# Altium schematic sheet S7CAS-PLEIADES-CARTE-MERE_P01_CNA.SchDoc
size Tabloid; DocumentNumber: 6; SheetNumber: 6; SheetTotal: 17; Sheet_Name: CNA; Size: 11x17
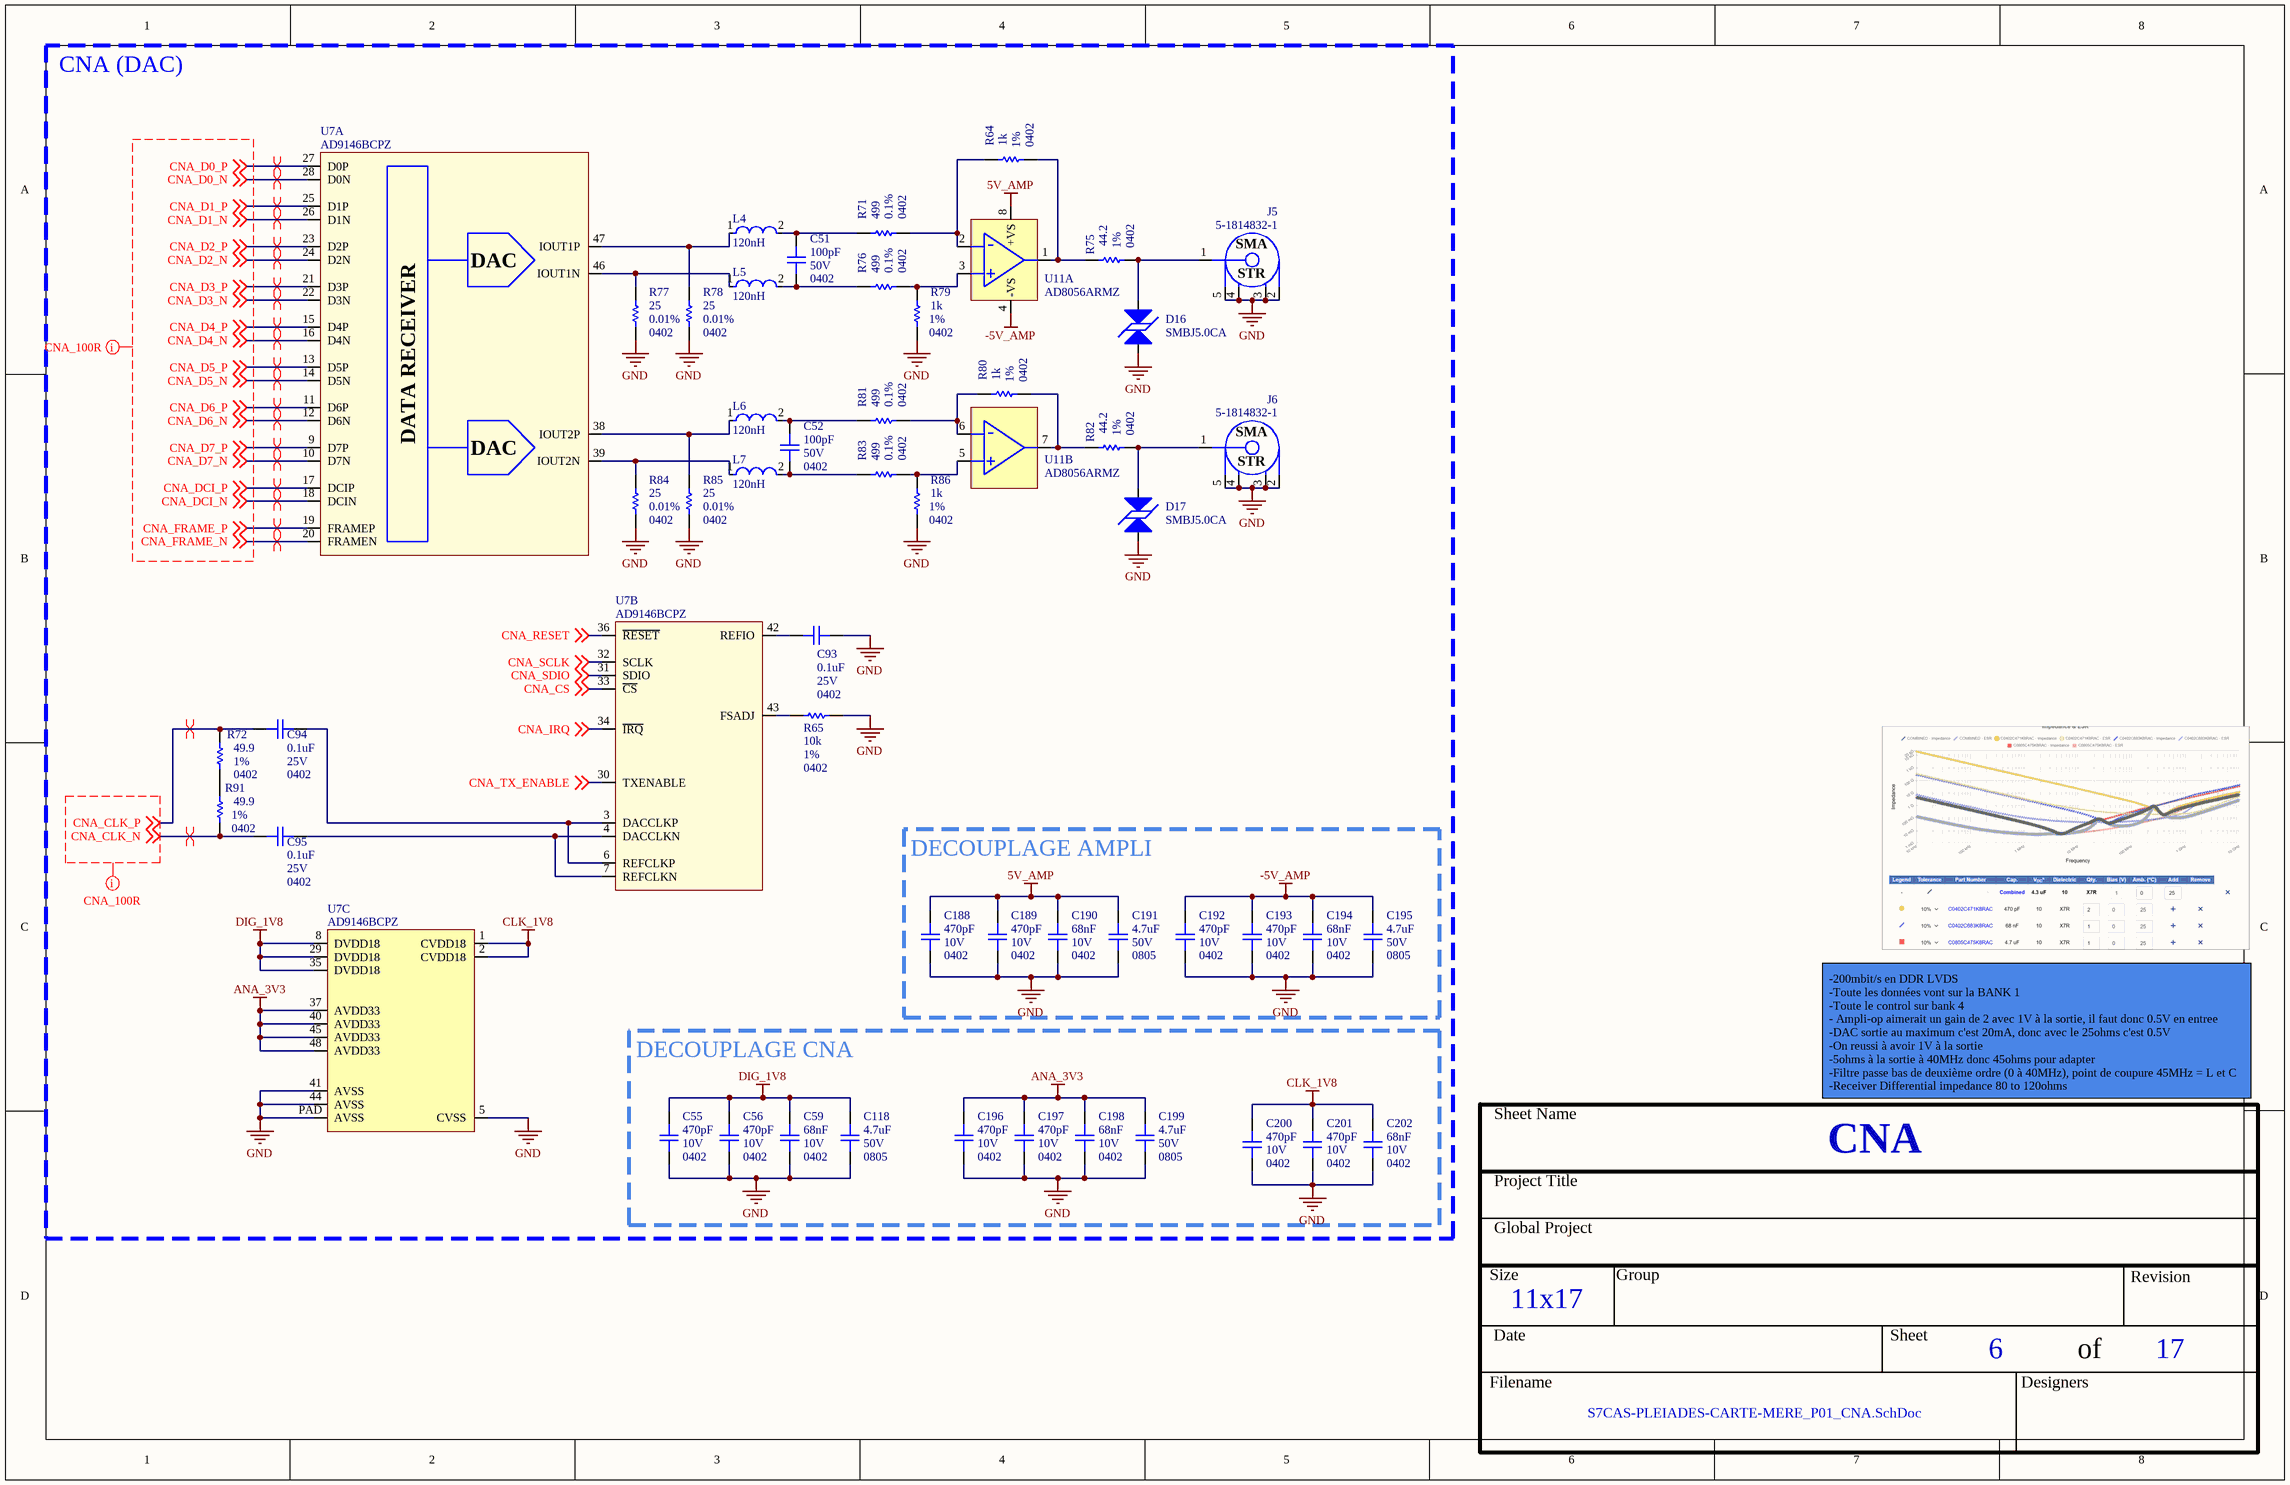
[diagram p0: S7CAS-PLEIADES-CARTE-MERE_P01_CNA.SchDoc]

## Parts
C51  value 100pF  Voltage: 50V  Package: 0402  [CAP_0402]  (hidden comment: CAP - 0402)
C52  value 100pF  Voltage: 50V  Package: 0402  [CAP_0402]  (hidden comment: CAP - 0402)
C55  value 470pF  Voltage: 10V  Package: 0402  [CAP_0402]  (hidden comment: CAP - 0402)
C56  value 470pF  Voltage: 10V  Package: 0402  [CAP_0402]  (hidden comment: CAP - 0402)
C59  value 68nF  Voltage: 10V  Package: 0402  [CAP_0402]  (hidden comment: CAP - 0402)
C93  value 0.1uF  Voltage: 25V  Package: 0402  [CAP_0402]  (hidden comment: CAP - 0402)
C94  value 0.1uF  Voltage: 25V  Package: 0402  [CAP_0402]  (hidden comment: CAP - 0402)
C95  value 0.1uF  Voltage: 25V  Package: 0402  [CAP_0402]  (hidden comment: CAP - 0402)
C118  value 4.7uF  Voltage: 50V  Package: 0805  [CAP_0805]  (hidden comment: CAP - 0805)
C188  value 470pF  Voltage: 10V  Package: 0402  [CAP_0402]  (hidden comment: CAP - 0402)
C189  value 470pF  Voltage: 10V  Package: 0402  [CAP_0402]  (hidden comment: CAP - 0402)
C190  value 68nF  Voltage: 10V  Package: 0402  [CAP_0402]  (hidden comment: CAP - 0402)
C191  value 4.7uF  Voltage: 50V  Package: 0805  [CAP_0805]  (hidden comment: CAP - 0805)
C192  value 470pF  Voltage: 10V  Package: 0402  [CAP_0402]  (hidden comment: CAP - 0402)
C193  value 470pF  Voltage: 10V  Package: 0402  [CAP_0402]  (hidden comment: CAP - 0402)
C194  value 68nF  Voltage: 10V  Package: 0402  [CAP_0402]  (hidden comment: CAP - 0402)
C195  value 4.7uF  Voltage: 50V  Package: 0805  [CAP_0805]  (hidden comment: CAP - 0805)
C196  value 470pF  Voltage: 10V  Package: 0402  [CAP_0402]  (hidden comment: CAP - 0402)
C197  value 470pF  Voltage: 10V  Package: 0402  [CAP_0402]  (hidden comment: CAP - 0402)
C198  value 68nF  Voltage: 10V  Package: 0402  [CAP_0402]  (hidden comment: CAP - 0402)
C199  value 4.7uF  Voltage: 50V  Package: 0805  [CAP_0805]  (hidden comment: CAP - 0805)
C200  value 470pF  Voltage: 10V  Package: 0402  [CAP_0402]  (hidden comment: CAP - 0402)
C201  value 470pF  Voltage: 10V  Package: 0402  [CAP_0402]  (hidden comment: CAP - 0402)
C202  value 68nF  Voltage: 10V  Package: 0402  [CAP_0402]  (hidden comment: CAP - 0402)
D16  SMBJ5.0CA  [TVS_PWR_SMBJ5.0CA]
D17  SMBJ5.0CA  [TVS_PWR_SMBJ5.0CA]
J5  5-1814832-1  [CONN_SMA_5-1814832-1]
J6  5-1814832-1  [CONN_SMA_5-1814832-1]
L4  120nH  [FP-0603HP-MFG]
L5  120nH  [FP-0603HP-MFG]
L6  120nH  [FP-0603HP-MFG]
L7  120nH  [FP-0603HP-MFG]
R64  value 1k  Package: 0402  Precision: 1%  [RES_0402]  (hidden comment: RES - 0402)
R65  value 10k  Package: 0402  Precision: 1%  [RES_0402]  (hidden comment: RES - 0402)
R71  value 499  Package: 0402  Precision: 0.1%  [RES_0402]  (hidden comment: RES - 0402)
R72  value 49.9  Package: 0402  Precision: 1%  [RES_0402]  (hidden comment: RES - 0402)
R75  value 44.2  Package: 0402  Precision: 1%  [RES_0402]  (hidden comment: RES - 0402)
R76  value 499  Package: 0402  Precision: 0.1%  [RES_0402]  (hidden comment: RES - 0402)
R77  value 25  Package: 0402  Precision: 0.01%  [RES_0402]  (hidden comment: RES - 0402)
R78  value 25  Package: 0402  Precision: 0.01%  [RES_0402]  (hidden comment: RES - 0402)
R79  value 1k  Package: 0402  Precision: 1%  [RES_0402]  (hidden comment: RES - 0402)
R80  value 1k  Package: 0402  Precision: 1%  [RES_0402]  (hidden comment: RES - 0402)
R81  value 499  Package: 0402  Precision: 0.1%  [RES_0402]  (hidden comment: RES - 0402)
R82  value 44.2  Package: 0402  Precision: 1%  [RES_0402]  (hidden comment: RES - 0402)
R83  value 499  Package: 0402  Precision: 0.1%  [RES_0402]  (hidden comment: RES - 0402)
R84  value 25  Package: 0402  Precision: 0.01%  [RES_0402]  (hidden comment: RES - 0402)
R85  value 25  Package: 0402  Precision: 0.01%  [RES_0402]  (hidden comment: RES - 0402)
R86  value 1k  Package: 0402  Precision: 1%  [RES_0402]  (hidden comment: RES - 0402)
R91  value 49.9  Package: 0402  Precision: 1%  [RES_0402]  (hidden comment: RES - 0402)
U7  AD9146BCPZ  [DAC_AD9146BCPZ]  (parts A,B,C of 3)
U11  AD8056ARMZ  [OPAMP_AD8056ARMZ]  (parts A,B of 2)

## Blocks framed on the sheet
CNA (DAC): C51 C52 C93-C95 D16 D17 J5 J6 L4-L7 R64 R65 R71 R72 R75-R86 R91 U7 U11
DECOUPLAGE AMPLI: C188-C195
DECOUPLAGE CNA: C55 C56 C59 C118 C196-C202

## Nets
5V_AMP: C188.2 C189.2 C190.2 C191.2 U11.8(+VS)
-5V_AMP: C192.2 C193.2 C194.2 C195.2 U11.4(-VS)
ANA_3V3: C196.2 C197.2 C198.2 C199.2 U7.37(AVDD33) U7.40(AVDD33) U7.45(AVDD33) U7.48(AVDD33)
CLK_1V8: C200.2 C201.2 C202.2 U7.1(CVDD18) U7.2(CVDD18)
DIG_1V8: C55.2 C56.2 C59.2 C118.2 U7.8(DVDD18) U7.29(DVDD18) U7.35(DVDD18)
GND: C55.1 C56.1 C59.1 C93.1 C118.1 C188.1 C189.1 C190.1 C191.1 C192.1 C193.1 C194.1 C195.1 C196.1 C197.1 C198.1 C199.1 C200.1 C201.1 C202.1 D16.2 D17.2 J5.2 J5.3 J5.4 J5.5 J6.2 J6.3 J6.4 J6.5 R65.2 R77.1 R78.1 R79.1 R84.1 R85.1 R86.1 U7.5(CVSS) U7.41(AVSS) U7.44(AVSS) U7.PAD(AVSS)
CNA_CLK_N: C95.2 R91.1 ; off-sheet CNA_CLK_N
CNA_CLK_P: C94.2 R72.2 ; off-sheet CNA_CLK_P
CNA_CS: U7.33(~{CS}) ; off-sheet CNA_CS
CNA_D0_N: U7.28(D0N) ; off-sheet CNA_D0_N
CNA_D0_P: U7.27(D0P) ; off-sheet CNA_D0_P
CNA_D1_N: U7.26(D1N) ; off-sheet CNA_D1_N
CNA_D1_P: U7.25(D1P) ; off-sheet CNA_D1_P
CNA_D2_N: U7.24(D2N) ; off-sheet CNA_D2_N
CNA_D2_P: U7.23(D2P) ; off-sheet CNA_D2_P
CNA_D3_N: U7.22(D3N) ; off-sheet CNA_D3_N
CNA_D3_P: U7.21(D3P) ; off-sheet CNA_D3_P
CNA_D4_N: U7.16(D4N) ; off-sheet CNA_D4_N
CNA_D4_P: U7.15(D4P) ; off-sheet CNA_D4_P
CNA_D5_N: U7.14(D5N) ; off-sheet CNA_D5_N
CNA_D5_P: U7.13(D5P) ; off-sheet CNA_D5_P
CNA_D6_N: U7.12(D6N) ; off-sheet CNA_D6_N
CNA_D6_P: U7.11(D6P) ; off-sheet CNA_D6_P
CNA_D7_N: U7.10(D7N) ; off-sheet CNA_D7_N
CNA_D7_P: U7.9(D7P) ; off-sheet CNA_D7_P
CNA_DCI_N: U7.18(DCIN) ; off-sheet CNA_DCI_N
CNA_DCI_P: U7.17(DCIP) ; off-sheet CNA_DCI_P
CNA_FRAME_N: U7.20(FRAMEN) ; off-sheet CNA_FRAME_N
CNA_FRAME_P: U7.19(FRAMEP) ; off-sheet CNA_FRAME_P
CNA_IRQ: U7.34(~{IRQ}) ; off-sheet CNA_IRQ
CNA_RESET: U7.36(~{RESET}) ; off-sheet CNA_RESET
CNA_SCLK: U7.32(SCLK) ; off-sheet CNA_SCLK
CNA_SDIO: U7.31(SDIO) ; off-sheet CNA_SDIO
CNA_TX_ENABLE: U7.30(TXENABLE) ; off-sheet CNA_TX_ENABLE
NetC51_1: C51.1 L5.2 R76.2
NetC51_2: C51.2 L4.2 R71.2
NetC52_1: C52.1 L7.2 R83.2
NetC52_2: C52.2 L6.2 R81.2
NetC93_2: C93.2 U7.42(REFIO)
NetC94_1: C94.1 U7.3(DACCLKP) U7.6(REFCLKP)
NetC95_1: C95.1 U7.4(DACCLKN) U7.7(REFCLKN)
NetD16_1: D16.1 J5.1 R75.1
NetD17_1: D17.1 J6.1 R82.1
NetL4_1: L4.1 R78.2 U7.47(IOUT1P)
NetL5_1: L5.1 R77.2 U7.46(IOUT1N)
NetL6_1: L6.1 R85.2 U7.38(IOUT2P)
NetL7_1: L7.1 R84.2 U7.39(IOUT2N)
NetR64_1: R64.1 R75.2 U11.1(OUT1)
NetR64_2: R64.2 R71.1 U11.2(-IN1)
NetR65_1: R65.1 U7.43(FSADJ)
NetR72_1: R72.1 R91.2
NetR76_1: R76.1 R79.2 U11.3(+IN1)
NetR80_1: R80.1 R82.2 U11.7(OUT2)
NetR80_2: R80.2 R81.1 U11.6(-IN2)
NetR83_1: R83.1 R86.2 U11.5(+IN2)

## Layout directives
net class CNA_100R: CNA_CLK_N, CNA_CLK_P, CNA_D0_N, CNA_D0_P, CNA_D1_N, CNA_D1_P, CNA_D2_N, CNA_D2_P, CNA_D3_N, CNA_D3_P, CNA_D4_N, CNA_D4_P, CNA_D5_N, CNA_D5_P, CNA_D6_N, CNA_D6_P, CNA_D7_N, CNA_D7_P, CNA_DCI_N, CNA_DCI_P, CNA_FRAME_N, CNA_FRAME_P
differential pair: CNA_CLK_N, CNA_CLK_P, CNA_D0_N, CNA_D0_P, CNA_D1_N, CNA_D1_P, CNA_D2_N, CNA_D2_P, CNA_D3_N, CNA_D3_P, CNA_D4_N, CNA_D4_P, CNA_D5_N, CNA_D5_P, CNA_D6_N, CNA_D6_P, CNA_D7_N, CNA_D7_P, CNA_DCI_N, CNA_DCI_P, CNA_FRAME_N, CNA_FRAME_P

## Notes on the sheet
- -200mbit/s en DDR LVDS
  -Toute les données vont sur la BANK 1
  -Toute le control sur bank 4
  - Ampli-op aimerait un gain de 2 avec 1V à la sortie, il faut donc 0.5V en entree
  -DAC sortie au maximum c'est 20mA, donc avec le 25ohms c'est 0.5V
  -On reussi à avoir 1V à la sortie
  -5ohms à la sortie à 40MHz donc 45ohms pour adapter
  -Filtre passe bas de deuxième ordre (0 à 40MHz), point de coupure 45MHz = L et C
  -Receiver Differential impedance 80 to 120ohms
- Sheet Name
- Project Title
- Global Project
- Size
- Group
- Revision
- Date
- Sheet
- of
- Filename
- Designers
- (in symbol CONN_SMA_5-1814832-1) SMA; STR
- (in symbol DAC_AD9146BCPZ, part A) DAC; DATA RECEIVER

## Library data of the parts
C51 C52 = CAP - 0402: 100 pF ±5% 50V Ceramic Capacitor C0G, NP0 0603 (1608 Metric); Mfg Part Number: GRM1885C1H101JA01D; Mfg: Murata Electronics; Current: *; CreatedBy: Jonathan Bouchard; Power: *; Precision: 5%
C55 C56 C188 C189 C192 C193 C196 C197 C200 C201 = CAP - 0402: Mfg Part Number: C0402C471K8RACAUTO; Precision: 10%; Current: *; CreatedBy: Jonathan Bouchard; Power: *
C59 C190 C194 C198 C202 = CAP - 0402: Mfg Part Number: C0402C683K8RAC; Precision: 10%; Current: *; CreatedBy: Jonathan Bouchard; Power: *
C93-C95 = CAP - 0402: 0.1 µF ±10% 25V Ceramic Capacitor X7R 0402 (1005 Metric); Mfg Part Number: CL05B104KA5NNNC; Mfg: Samsung Electro-Mechanics; Current: *; CreatedBy: Jonathan Bouchard; Power: *; Precision: 10%; Part Number #1: CL05B104KA5NNNC
C118 C191 C195 C199 = CAP - 0805: 4.7 µF ±10% 50V Ceramic Capacitor X5R 0805 (2012 Metric); Mfg Part Number: GRT21BR61H475KE13L; Mfg: Murata Electronics; Current: *; CreatedBy: Jonathan Bouchard; Power: *; Precision: 10%
D16 D17 = TVS_PWR_SMBJ5.0CA: TVS - BIDIR 5V 9.2V 600W - DO214AA; Manufacturer #1: Littelfuse Inc.; Value: Vbr = 6.4V -  Clamp = 9.2V; Voltage Rating: 5V Standoff; Current Rating: 65.3 A (Ipp); Power Max: 600W (Pppm); GRAMS Lib Spec: 2.8; Magnetic Material: UNKNOWN; Polarized: NO; Tolerance: *; HelpURL: http://www.littelfuse.com/~/media/electronics/datasheets/tvs_diodes/littelfuse_tvs_diode_smbj_datasheet.pdf.pdf; CreatedBy/Date: Jonathan Bouchard - 2019-03-22; VerifiedBy: Nicolas V. (2019-05-06); Temperature: -65°C ~ 150°C (TJ); Package: DO214AA; Manufacturer #2: *; Note: *; Assembly Type: SMD; Part Number #2: *; Part Number #1: SMBJ5.0CA; Supplier 1: Digi-Key; Supplier Part Number 1: SMBJ5.0CALFCT-ND; Cryo: UNKNOWN
J5 J6 = CONN_SMA_5-1814832-1: CONN -  SMA JACK STR 50 OHM - TH; Mfg: TE Connectivity AMP Connectors; Voltage: *; Current: *; Power: *; Mfg Part Number: 5-1814832-1; HelpURL: http://www.te.com/commerce/DocumentDelivery/DDEController?Action=srchrtrv&DocNm=1814832&DocType=Customer+Drawing&DocLang=English; CreatedBy: Jonathan Bouchard; Temperature: -65°C ~ 165°C; Value: *; Precision: *; Package: TH-5; Supplier 1: Digikey; Supplier Part Number 1: A97594-ND
L4-L7 = CMP-11268-000221-1: High Q Ceramic Chip Inductors 3.3nH 5% 0.024Ohm 1900mA 0603; DC Resistance (DCR): 24mR; Test Frequency: 250MHz; Max DC Current: 1.9A; Q Factor: 104; Self Resonant Frequency: 9.6GHz; Inductance: 3.3nH; Core Material: Ceramic; Height: 0.94mm; RoHS Compliant: Yes; Width: 1.09mm; Package Quantity: 2000; Termination: SMD/SMT; Series: 0603HP; Length: 1.75mm; Lead Free: Contains Lead; Packaging: Tape and Reel; Tolerance: 5%; Min Operating Temperature: -40°C; Max Operating Temperature: 125°C; Case/Package: 0603
R64 R79 R80 R86 = RES - 0402: 1 kOhms ±1% 0.1W, 1/10W Chip Resistor 0402 (1005 Metric) Automotive AEC-Q200 Thick Film; Mfg Part Number: ERJ-2RKF1001X; Voltage: 50V; Mfg: Panasonic Electronic Components; Current: *; CreatedBy: Jonathan Bouchard; Power: 1/10W; Part Number #1: ERJ-2RKF1001X
R65 = RES - 0402: 10 kOhms ±1% 0.063W, 1/16W Chip Resistor 0402 (1005 Metric) Automotive AEC-Q200 Thick Film; Mfg Part Number: RMCF0402FT10K0; Voltage: 75V; Current: *; CreatedBy: Jonathan Bouchard; Power: 1/16W; Part Number #1: RMCF0402FT10K0
R71 R76 R81 R83 = RES - 0402: 499 Ohms ±0.1% 0.063W, 1/16W Chip Resistor 0402 (1005 Metric) Automotive AEC-Q200 Thin Film; Mfg Part Number: ERA-2AEB4990X; Voltage: TBD; Mfg: Panasonic Electronic Components; Current: *; CreatedBy: Jonathan Bouchard; Power: 1/16W
R72 R91 = RES - 0402: 49.9 Ohms ±1% 0.1W, 1/10W Chip Resistor 0402 (1005 Metric) Automotive AEC-Q200 Thick Film; Mfg Part Number: CRCW040249R9FKED; Voltage: 75V; Mfg: Vishay Dale; Current: *; CreatedBy: Jonathan Bouchard; Power: 1/10W; Part Number #1: CRCW040249R9FKED
R75 R82 = RES - 0402: 44.2 Ohms ±1% 0.1W, 1/10W Chip Resistor 0402 (1005 Metric) Automotive AEC-Q200 Thick Film; Mfg Part Number: ERJ-2RKF44R2X; Voltage: TBD; Mfg: Panasonic Electronic Components; Current: *; CreatedBy: Jonathan Bouchard; Power: 1/10W
R77 R78 R84 R85 = RES - 0402: 25 Ohms ±0.1% 0.05W, 1/20W Chip Resistor 0402 (1005 Metric) RF, High Frequency Thin Film; Mfg Part Number: FC0402E25R0BTT0; Voltage: TBD; Mfg: Vishay Dale Thin Film; Current: *; CreatedBy: Jonathan Bouchard; Power: 1/20W
U7 = DAC_AD9146BCPZ: DAC - 16BIT SRL HIGH SPEED - QFN-48; Voltage: 3.13 V ~ 3.47 V / 1.71 V ~ 1.89 V; Mfg: Analog Devices Inc.; Current: *; Power: *; Mfg Part Number: AD9146BCPZ; HelpURL: http://www.analog.com/media/en/technical-documentation/data-sheets/AD9146.PDF; CreatedBy: Jonathan Bouchard; Temperature: -40°C ~ 85°C; Value: *; Precision: 16 Bit; Package: QFN-48; Supplier 1: Digikey; Supplier Part Number 1: AD9146BCPZ-ND
U11 = OPAMP_AD8056ARMZ: OPAMP - VFB 300MHZ - 8MSOP; Voltage: 8 V ~ 12 V, ±4 V ~ 6 V; Current: 60mA; Mfg: Analog Devices; Power: *; Mfg Part Number: AD8056ARMZ; HelpURL: http://www.analog.com/media/en/technical-documentation/data-sheets/AD8055_8056.pdf; CreatedBy: Jonathan Bouchard; Temperature: -40°C ~ 125°C; Value: *; Precision: *; Package: MSOP-8; Supplier 1: Digikey; Supplier Part Number 1: AD8056ARMZ-REEL7CT-ND